# EAGLE design led_board (EAGLE 6.1)
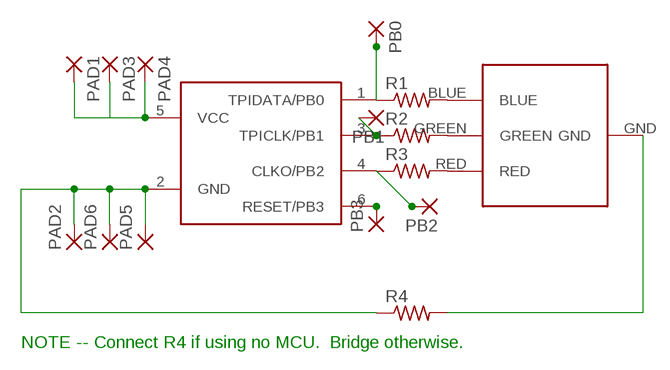
[diagram p0: schematic, sheet 1]

## Parts
PAD1  1,6/0,8  [1,6/0,8]
PAD2  1,6/0,8  [1,6/0,8]
PAD3  1,6/0,8  [1,6/0,8]
PAD4  1,6/0,8  [1,6/0,8]
PAD5  1,6/0,8  [1,6/0,8]
PAD6  1,6/0,8  [1,6/0,8]
PB0  1,6/0,8  [1,6/0,8]
PB1  1,6/0,8  [1,6/0,8]
PB2  1,6/0,8  [1,6/0,8]
PB3  1,6/0,8  [1,6/0,8]
R1  R-US_M1206  [M1206]
R2  R-US_M1206  [M1206]
R3  R-US_M1206  [M1206]
R4  R-US_M1206  [M1206]
U$1  BIVAR-RGB-LED  [7.6X7.6MM-LED]
U$2  ATTINY10SOT  [SOT23-6]

## Nets
N$2: PAD2.1(P) PAD5.1(P) PAD6.1(P) R4.1 U$2.2(GND)
N$5: R1.2 U$1.BLUE
N$6: R2.2 U$1.GREEN
N$7: R3.2 U$1.RED
N$8: R4.2 U$1.GND
PB0: PB0.1(P) R1.1 U$2.1(TPIDATA/PB0)
PB1: PB1.1(P) R2.1 U$2.3(TPICLK/PB1)
PB2: PB2.1(P) R3.1 U$2.4(CLKO/PB2)
PB3: PB3.1(P) U$2.6(RESET/PB3)
VCC: PAD1.1(P) PAD3.1(P) PAD4.1(P) U$2.5(VCC)

## Notes on the sheet
- NOTE -- Connect R4 if using no MCU.  Bridge otherwise.

## Library data of the parts
PAD1-PAD6 PB0 PB1-PB3 = wirepad:1,6/0,8: THROUGH-HOLE PAD
R1-R4 = resistor:R-US_: RESISTOR, American symbol
U$1 = *Personal Library:BIVAR-RGB-LED
U$2 = *Personal Library:ATTINY10

## Board
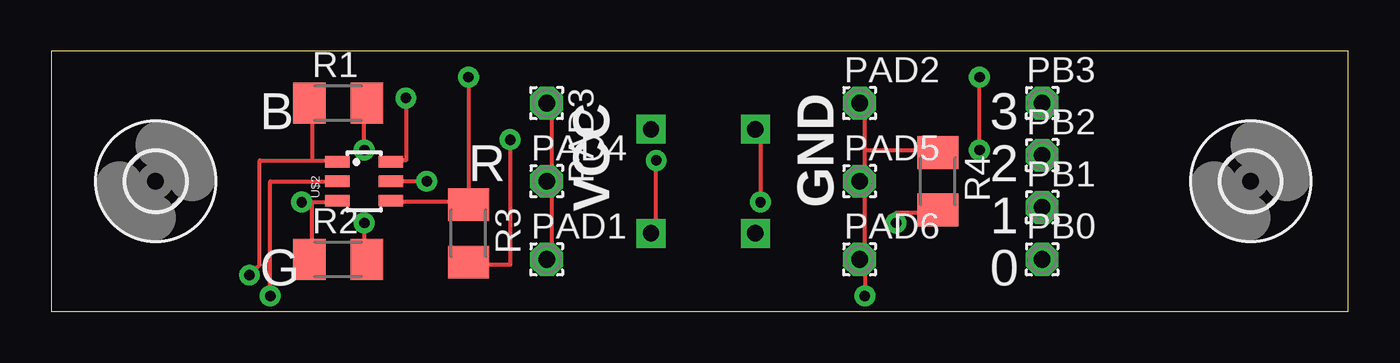
[diagram p1: board, top side]
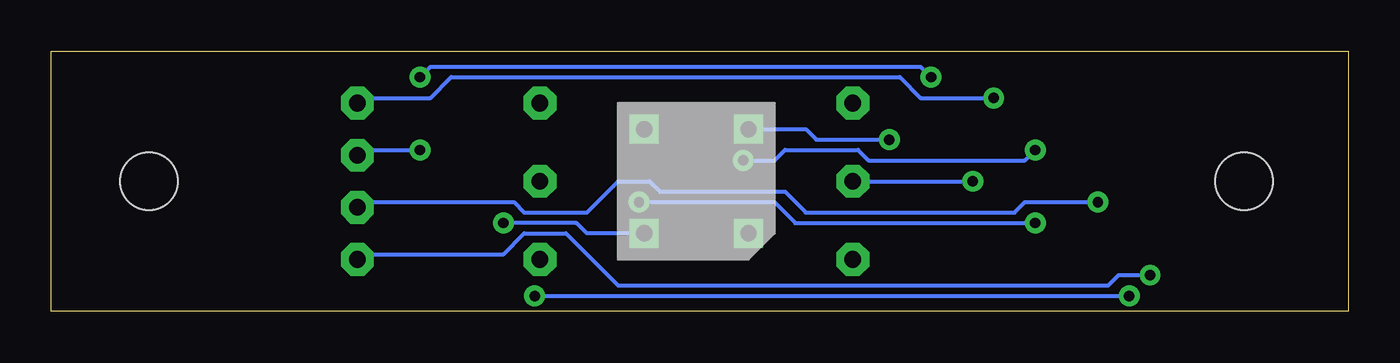
[diagram p2: board, bottom side, seen from below]

Size 63.17 x 12.69 mm. Coordinates in mm from the lower left corner, seen from the top.
Outline: 0,0 63.17,0 63.17,12.69 0,12.69 0,0
Copper layers (1*16): Top 0.035mm / dielectric 1.5mm / Bottom 0.035mm
Design rules: minimum track width 8mil, minimum drill 20mil, track to track 8mil, track to pad 8mil, pad to pad 8mil, via to via 8mil, smd to smd 8mil, copper to edge 10mil, drill to drill 8mil, minimum pad ring 12mil, minimum via ring 10mil, stop-mask expansion 4mil, vias tented up to drill 25mil, thermal gap 10mil

### Footprints (pad centres in the part's own frame; a part is rotated, then mirrored left to right if it is on the bottom)
2,8 = hole 2.8: 0,0
1,6/0,8 = drill 0.813 pad 1.6 octagon: 1 0,0
M1206 = smd 1.6 x 2: 1 -1.4,0; 2 1.4,0
7.6X7.6MM-LED = drill 0.8 square: BLUE 2.54,-2.54; GND -2.54,-2.54; GREEN -2.54,2.54; RED 2.54,2.54
SOT23-6 = smd 0.55 x 1.2: 1 0.95,1.3; 2 0,1.3; 3 -0.95,1.3; 4 -0.95,-1.3; 5 0,-1.3; 6 0.95,-1.3

### Placement (x,y rotation side)
E$1  [2,8]  5.08,6.35 0 top
E$2  [2,8]  58.42,6.35 0 top
PAD1  24.13,2.54 0 top
PAD2  39.37,10.16 0 top
PAD3  24.13,10.16 270 top
PAD4  24.13,6.35 0 top
PAD5  39.37,6.35 0 top
PAD6  39.37,2.54 0 top
PB0  48.26,2.54 0 top
PB1  48.26,5.08 0 top
PB2  48.26,7.62 0 top
PB3  48.26,10.16 0 top
R1  13.97,10.16 0 top
R2  13.97,2.54 0 top
R3  20.32,3.81 270 top
R4  43.18,6.35 270 top
U$1  31.75,6.35 0 bottom
U$2  15.24,6.35 90 top

### Tracks (layer width: path | path; a pad name or v marks a point on that pad's centre or on a via)
N$2  (via drill 0.51)
  Top 0.203: 39.62,6.35 39.62,2.79 PAD6.1 39.62,2.29 v39.62,0.76 | 39.62,6.35 39.62,7.87 | 39.62,7.87 39.62,9.91 PAD2.1 | 39.62,6.35 PAD5.1 | U$2.2 10.67,6.35 v10.67,0.76 | 39.62,7.87 43.18,7.87 R4.1
  Bottom 0.203: v39.62,0.76 v10.67,0.76
N$5  (via drill 0.51)
  Top 0.203: v15.24,7.87 15.24,9.91 R1.2 | v29.46,7.37 29.46,3.81 U$1.BLUE
  Bottom 0.203: v15.24,7.87 15.75,7.37 23.37,7.37 23.88,7.87 27.43,7.87 27.94,7.37 v29.46,7.37
N$6  (via drill 0.51)
  Top 0.203: v15.24,4.32 15.24,2.79 R2.2 | v34.54,5.33 34.54,8.89 U$1.GREEN
  Bottom 0.203: v15.24,4.32 26.92,4.32 27.94,5.33 v34.54,5.33
N$7  (via drill 0.51)
  Top 0.203: v22.35,8.38 22.35,2.29 20.32,2.29 R3.2
  Bottom 0.203: v22.35,8.38 25.91,8.38 26.42,8.89 U$1.RED
N$8  (via drill 0.51)
  Top 0.203: v41.15,4.32 41.15,4.83 43.18,4.83 R4.2
  Bottom 0.203: v41.15,4.32 37.59,4.32 37.08,3.81 U$1.GND
PB0  (via drill 0.51)
  Top 0.203: 12.7,7.37 13.72,7.37 U$2.1 | 12.7,7.37 12.7,9.91 R1.1 | 12.7,7.37 10.16,7.37 10.16,2.29 v9.65,1.78
  Bottom 0.203: v9.65,1.78 11.18,1.78 11.68,1.27 35.56,1.27 38.1,3.81 40.13,3.81 41.15,2.79 48.26,2.79 PB0.1
PB1  (via drill 0.51)
  Top 0.203: 12.7,5.33 13.72,5.33 U$2.3 | 12.7,5.33 12.7,2.79 R2.1 | v12.19,5.33 12.7,5.33
  Bottom 0.203: v12.19,5.33 15.75,5.33 16.26,4.83 26.42,4.83 27.43,5.84 33.53,5.84 34.04,6.35 35.56,6.35 37.08,4.83 40.13,4.83 40.64,5.33 48.26,5.33 PB1.1
PB2  (via drill 0.51)
  Top 0.203: 20.32,5.33 16.76,5.33 U$2.4 | v20.32,11.43 20.32,5.33 | v45.21,7.87 v45.21,11.43 | 20.32,5.33 R3.1
  Bottom 0.203: v20.32,11.43 20.83,11.94 44.7,11.94 v45.21,11.43 | v45.21,7.87 48.26,7.87 PB2.1
PB3  (via drill 0.51)
  Top 0.203: v17.27,10.41 17.27,7.37 16.76,7.37 U$2.6
  Bottom 0.203: v17.27,10.41 20.83,10.41 21.84,11.43 43.69,11.43 44.7,10.41 48.26,10.41 PB3.1
VCC  (via drill 0.51)
  Top 0.203: 24.38,6.35 24.38,2.79 PAD1.1 | 24.38,6.35 24.38,9.91 PAD3.1 | 24.38,6.35 PAD4.1 | v18.29,6.35 U$2.5
  Bottom 0.203: PAD4.1 v18.29,6.35

### Text on the board
tPlace: VCC | B | 3 | R | 2 | GND | 1 | G | 0